# EAGLE design main (EAGLE 9.5.2)
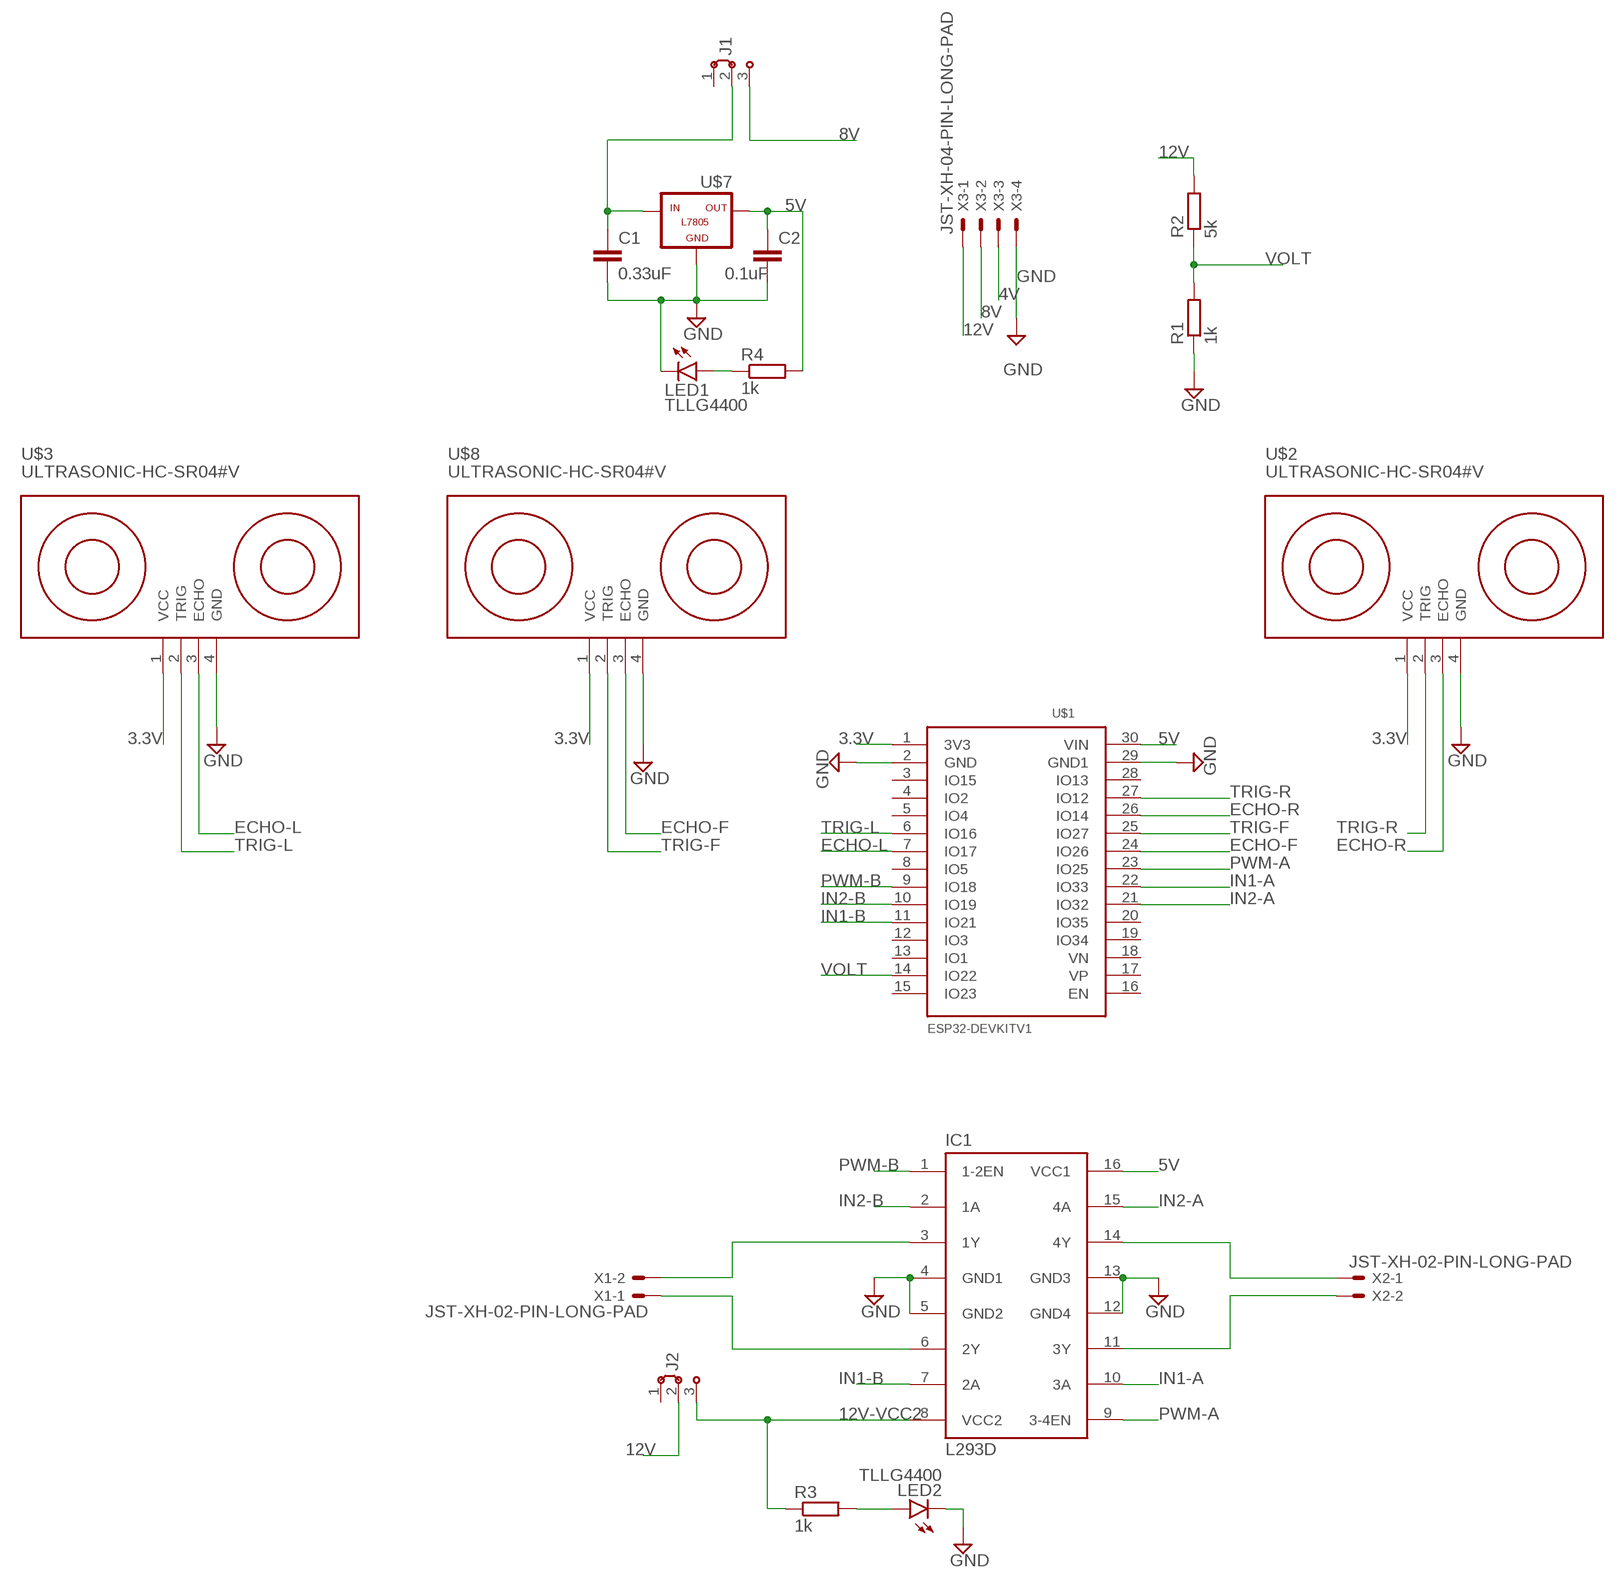
[diagram p0: schematic, sheet 1]

## Parts
C1  0.33uF  C2,5-3  [C2.5-3]
C2  0.1uF  C2,5-3  [C2.5-3]
IC1  L293D  [DIL16]
J1  J2X5MM  [05C]
J2  J2X5MM  [05C]
LED1  TLLG4400  [LED3MM]
LED2  TLLG4400  [LED3MM]
R1  1k  R-EU_0207/10  [0207/10]
R2  5k  R-EU_0207/10  [0207/10]
R3  1k  R-EU_0207/10  [0207/10]
R4  1k  R-EU_0207/10  [0207/10]
U$1  ESP32DEVKITV1  [ESP32-DEVKITV1]
U$2  ULTRASONIC-HC-SR04#V  [ULTRASONIC-HC-SR04#V]
U$3  ULTRASONIC-HC-SR04#V  [ULTRASONIC-HC-SR04#V]
U$7  -L7805  [L7805]
U$8  ULTRASONIC-HC-SR04#V  [ULTRASONIC-HC-SR04#V]
X1  JST-XH-02-PIN-LONG-PAD  [JST-XH-02-PACKAGE-LONG-PAD]
X2  JST-XH-02-PIN-LONG-PAD  [JST-XH-02-PACKAGE-LONG-PAD]
X3  JST-XH-04-PIN-LONG-PAD  [JST-XH-04-PACKAGE-LONG-PAD]

## Nets
3.3V: U$1.1(3V3) U$2.1(VCC) U$3.1(VCC) U$8.1(VCC)
4V: X3.3
5V: C2.1 IC1.16(VCC1) R4.2 U$1.30(VIN) U$7.OUT
8V: J1.3 X3.2
12V: J2.2 R2.2 X3.1
12V-VCC2: IC1.8(VCC2) J2.3 R3.1
ECHO-F: U$1.24(IO26) U$8.3(ECHO)
ECHO-L: U$1.7(IO17) U$3.3(ECHO)
ECHO-R: U$1.26(IO14) U$2.3(ECHO)
GND: C1.2 C2.2 IC1.4(GND1) IC1.5(GND2) IC1.12(GND4) IC1.13(GND3) LED1.K(C) LED2.K(C) R1.1 U$1.2(GND) U$2.4(GND) U$3.4(GND) U$7.GND U$8.4(GND) X3.4
IN1-A: IC1.10(3A) U$1.22(IO33)
IN1-B: IC1.7(2A) U$1.11(IO21)
IN2-A: IC1.15(4A) U$1.21(IO32)
IN2-B: IC1.2(1A) U$1.10(IO19)
N$1: IC1.3(1Y) X1.2
N$2: IC1.6(2Y) X1.1
N$3: IC1.14(4Y) X2.1
N$4: IC1.11(3Y) X2.2
N$5: LED1.A R4.1
N$6: U$1.29(GND1) ; supply symbol labelled GND
N$7: C1.1 J1.2 U$7.IN
N$9: LED2.A R3.2
PWM-A: IC1.9(3-4EN) U$1.23(IO25)
PWM-B: IC1.1(1-2EN) U$1.9(IO18)
TRIG-F: U$1.25(IO27) U$8.2(TRIG)
TRIG-L: U$1.6(IO16) U$3.2(TRIG)
TRIG-R: U$1.27(IO12) U$2.2(TRIG)
VOLT: R1.2 R2.1 U$1.14(IO22)
Unconnected: J1.1 J2.1 U$1.3(IO15) U$1.4(IO2) U$1.5(IO4) U$1.8(IO5) U$1.12(IO3) U$1.13(IO1) U$1.15(IO23) U$1.16(EN) U$1.17(VP) U$1.18(VN) U$1.19(IO34) U$1.20(IO35) U$1.28(IO13)

## Library data of the parts
C1 C2 = capacitor-wima:C: CAPACITOR naming: grid - package width
IC1 = st-microelectronics:L293D: PUSH-PULL 4 CHANNEL DRIVER
J1 J2 = jumper:J2: Jumper switch 2 x 2.5 mm
LED1 LED2 = led:TLLG4400: Low Current (2mA) LED 3 mm Tinted Diffused Package color GREEN Source: Data sheet <http://www.farnell.com/datasheets/391098.pdf>; MF: VISHAY SEMICONDUCTOR; OC_FARNELL: 1612435
R1-R4 = rcl:R-EU_: RESISTOR, European symbol; SPICEPREFIX: R
U$1 = ESP32-DEVKITV1:ESP32DEVKITV1
U$2 U$3 U$8 = diy-modules:ULTRASONIC-HC-SR04: Ultrasonic Ranging Module HC-SR04 More details available here: http://randomnerdtutorials.com/complete-guide-for-ultrasonic-sensor-hc-sr04/ Click here to find device on ebay.com <http://www.ebay.com/sch/hc+sr04+ultrasonic>
U$7 = tango:-L7805
X1 X2 = Rembrandt Electronics - JST XH Connectors v1-0:JST-XH-02-PIN: JST XH Connector 2 Pin Wire to board connector. Pitch: 2,54 mm, (0.100") Number of pins: 2 Created by Rembrandt Electronics www.rembrandtelectronics.com
X3 = Rembrandt Electronics - JST XH Connectors v1-0:JST-XH-04-PIN: JST XH Connector 2 Pin Wire to board connector. Pitch: 2,54 mm, (0.100") Number of pins: 4 Created by Rembrandt Electronics www.rembrandtelectronics.com

## Board
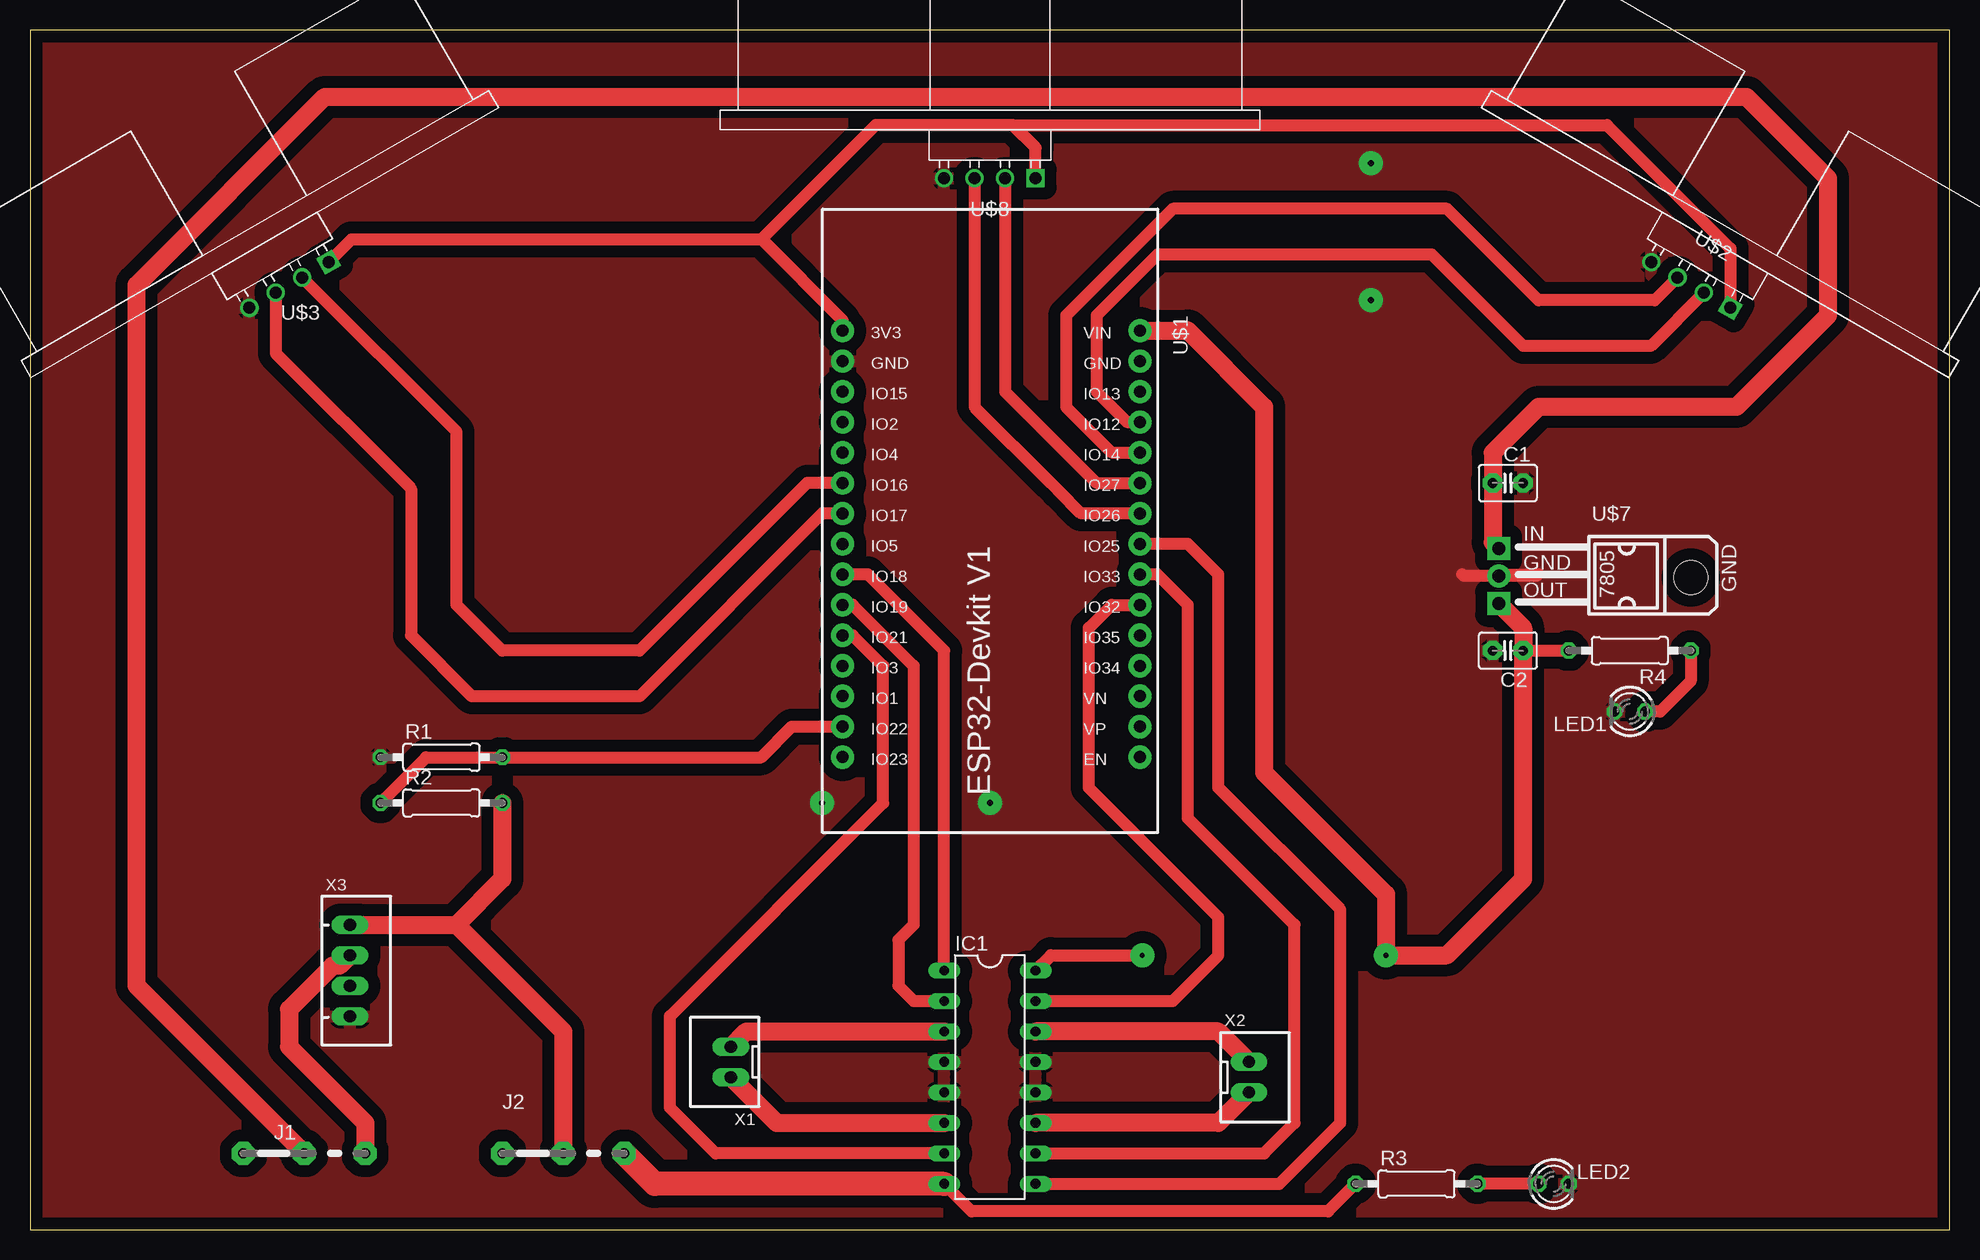
[diagram p1: board, top side]
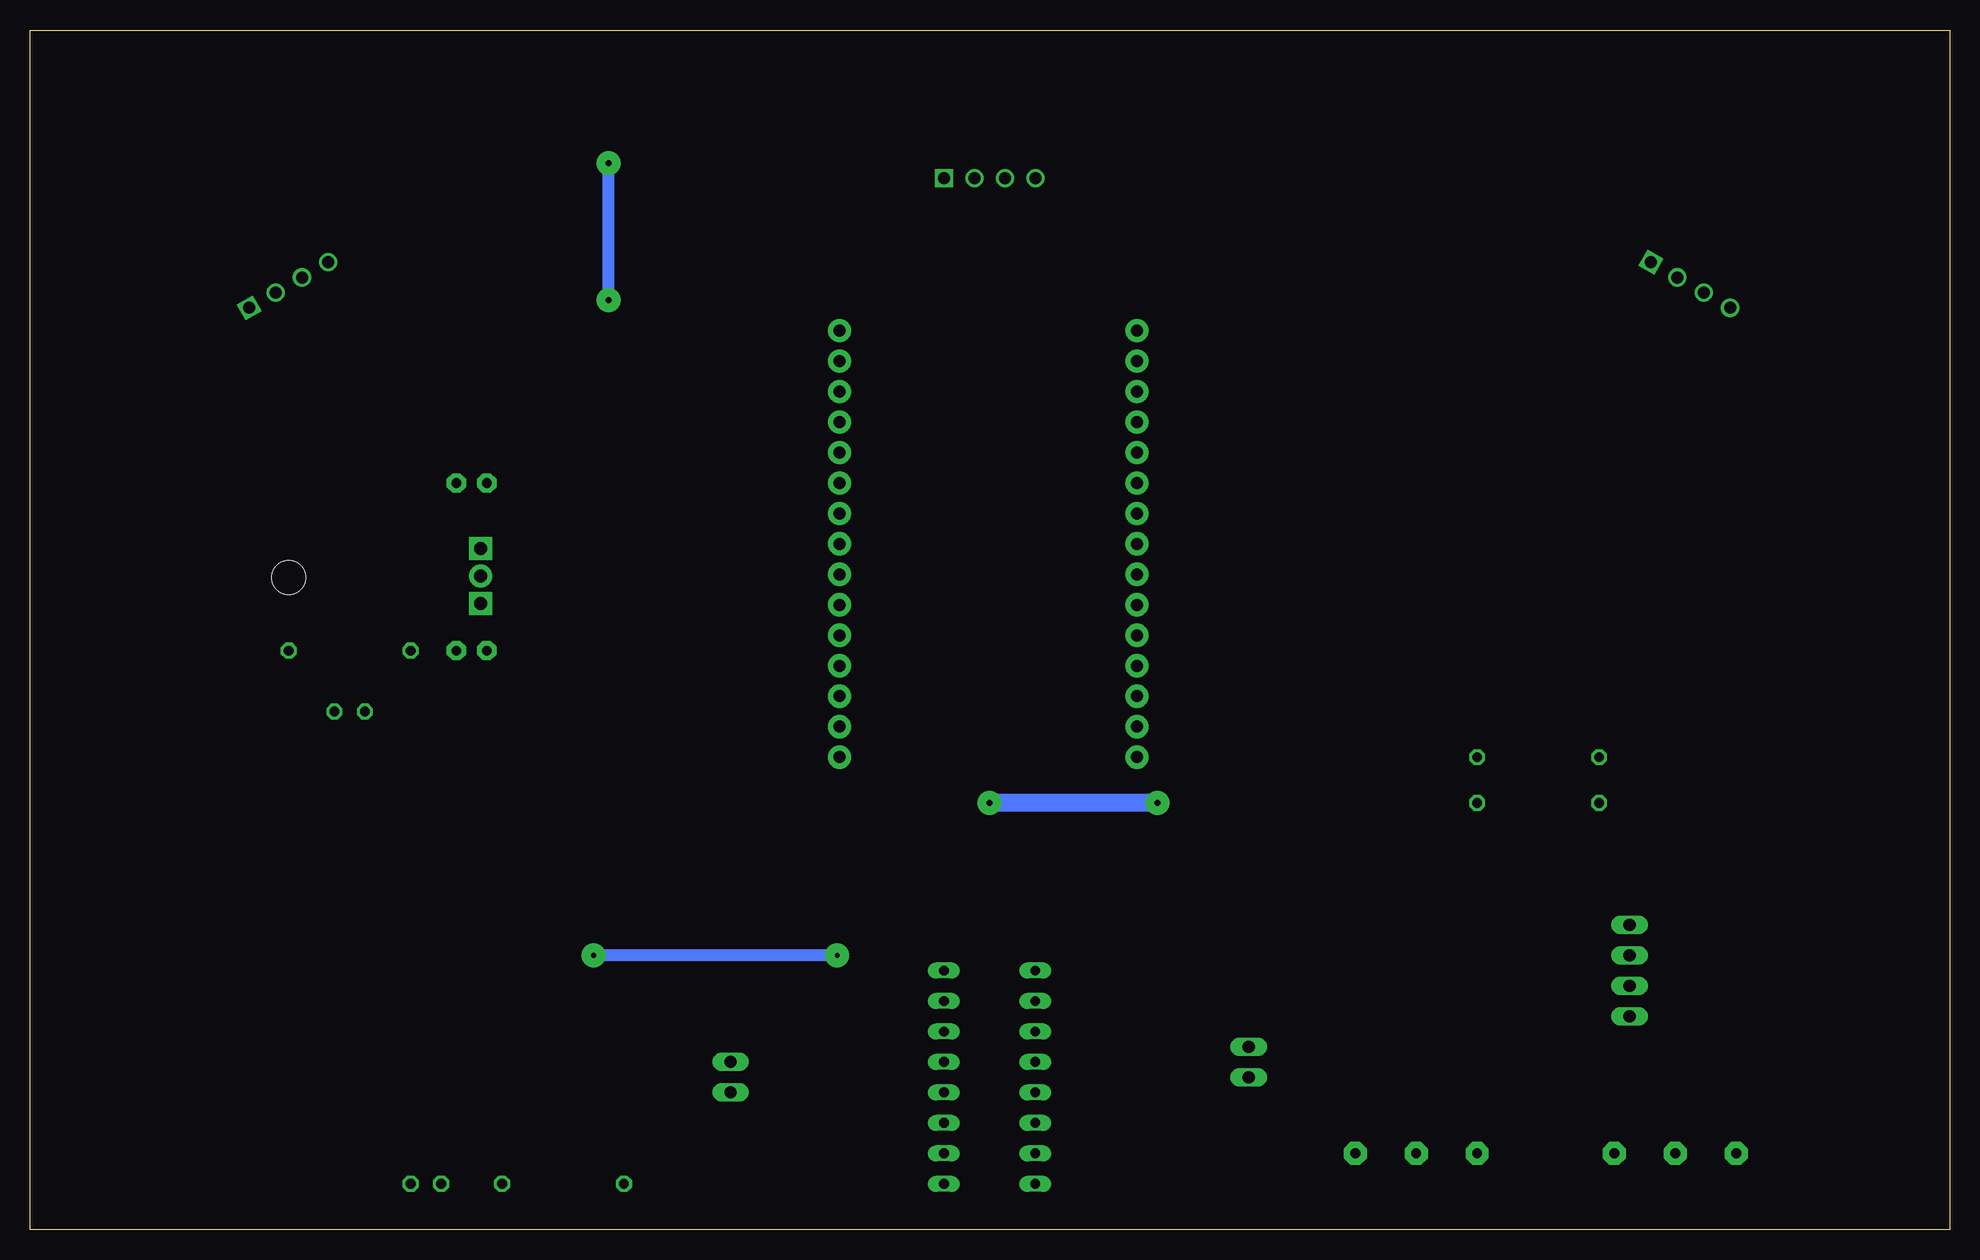
[diagram p2: board, bottom side, seen from below]

Size 160 x 100 mm. Coordinates in mm from the lower left corner, seen from the top.
Outline: 0,0 160,0 160,100 0,100 0,0
Copper layers (1*16): Top 0.035mm / dielectric 1.5mm / Bottom 0.035mm
Design rules "default": minimum track width 6mil, minimum drill 0.35mm, track to track 6mil, track to pad 6mil, pad to pad 6mil, via to via 6mil, smd to smd 6mil, copper to edge 40mil, drill to drill 6mil, minimum pad ring 10mil, minimum via ring 8mil, stop-mask expansion 4mil, vias tented up to drill 0mil, thermal gap 10mil

### Footprints (pad centres in the part's own frame; a part is rotated, then mirrored left to right if it is on the bottom)
C2.5-3 = drill 0.813 pad 1.6 octagon: 1 -1.27,0; 2 1.27,0
DIL16 = drill 0.813 long: 1 -8.89,-3.81; 2 -6.35,-3.81; 3 -3.81,-3.81; 4 -1.27,-3.81; 5 1.27,-3.81; 6 3.81,-3.81; 7 6.35,-3.81; 8 8.89,-3.81; 9 8.89,3.81; 10 6.35,3.81; 11 3.81,3.81; 12 1.27,3.81; 13 -1.27,3.81; 14 -3.81,3.81; 15 -6.35,3.81; 16 -8.89,3.81
05C = drill 0.813 pad 1.905 octagon: 1 -2.54,0; 2 2.54,0; 3 7.62,0
LED3MM = drill 0.813 octagon: A -1.27,0; K 1.27,0
0207/10 = drill 0.813 octagon: 1 -5.08,0; 2 5.08,0
ESP32-DEVKITV1 = drill 1 pad 1.93: 1 -22.87,-13.54; 2 -20.33,-13.54; 3 -17.79,-13.54; 4 -15.25,-13.54; 5 -12.71,-13.54; 6 -10.17,-13.54; 7 -7.63,-13.54; 8 -5.09,-13.54; 9 -2.55,-13.54; 10 -0.01,-13.54; 11 2.53,-13.54; 12 5.07,-13.54; 13 7.61,-13.54; 14 10.15,-13.54; 15 12.69,-13.54; 16 12.69,11.23; 17 10.15,11.23; 18 7.61,11.23; 19 5.07,11.23; 20 2.53,11.23; 21 -0.01,11.23; 22 -2.55,11.23; 23 -5.09,11.23; 24 -7.63,11.23; 25 -10.17,11.23; 26 -12.71,11.23; 27 -15.25,11.23; 28 -17.79,11.23; 29 -20.33,11.23; 30 -22.87,11.23
ULTRASONIC-HC-SR04#V = drill 1 square: 1 -3.81,0 | drill 1: 2 -1.27,0; 3 1.27,0; 4 3.81,0
L7805 = drill 1.1 pad 1.93: GND 0.127,-9.652 | drill 1.1 pad 1.93 square: IN -2.159,-9.652; OUT 2.413,-9.652 | hole 2.8: 0.254,6.35
JST-XH-02-PACKAGE-LONG-PAD = drill 1.016 long: 1 -1.27,0; 2 1.27,0
JST-XH-04-PACKAGE-LONG-PAD = drill 1.016 long: 1 -3.81,0; 2 -1.27,0; 3 1.27,0; 4 3.81,0

### Placement (x,y rotation side)
C1  123.19,62.23 0 top
C2  123.19,48.26 180 top
IC1  80.01,12.7 270 top
J1  20.32,6.35 0 top
J2  41.91,6.35 0 top
LED1  133.35,43.18 180 top
LED2  127,3.81 0 top
R1  34.29,39.37 0 top
R2  34.29,35.56 0 top
R3  115.57,3.81 0 top
R4  133.35,48.26 180 top
U$1  81.28,52.07 270 top
U$2  138.43,78.74 150 top
U$3  21.59,78.74 210 top
U$7  132.08,54.61 270 top
U$8  80.01,87.63 180 top
X1  58.42,13.97 90 top
X2  101.6,12.7 270 top
X3  26.67,21.59 270 top

### Tracks (layer width: path | path; a pad name or v marks a point on that pad's centre or on a via)
3.3V
  Top 1: U$3.1 26.8,82.55 60.96,82.55 | 60.96,82.55 67.74,75.77 U$1.1 | U$8.1 83.82,90.17 81.92,92.08 | 81.92,92.08 70.48,92.08 60.96,82.55 | 81.92,92.08 131.44,92.08 141.73,81.79 U$2.1
5V  (via drill 0.4 pad 2)
  Top 1: C2.1 R4.2 | IC1.16 85.09,22.86 v92.71,22.86
  Top 1.5: U$1.30 96.51,74.94 102.87,68.58 102.87,38.1 113.03,27.94 v113.03,22.86 118.11,22.86 124.46,29.21 C2.1 124.46,50.16 U$7.OUT
  Bottom 1: v92.71,22.86 v113.03,22.86
8V
  Top 1.5: X3.2 25.79,21.98 25.22,21.98 21.59,18.36 21.59,15.24 27.94,8.89 J1.3
12V
  Top 1.5: X3.1 35.56,25.4 | J2.2 44.45,16.51 35.56,25.4 | R2.2 39.37,29.21 35.56,25.4
12V-VCC2
  Top 1: R3.1 108.2,1.52 78.49,1.52 IC1.8
  Top 2: J2.3 52.07,3.81 IC1.8
ECHO-F
  Top 1: U$8.3 78.74,68.58 85.09,62.23 85.72,61.59 | U$1.24 87.62,59.7 85.72,61.59 | 85.72,61.59
ECHO-L
  Top 1: U$3.3 20.49,73.03 31.75,61.77 31.75,49.53 36.83,44.45 50.8,44.45 66.04,59.69 U$1.7
ECHO-R
  Top 1: U$2.3 135.43,77.47 125.73,77.47 118.11,85.09 95.25,85.09 86.36,76.2 86.36,68.58 90.16,64.78 U$1.26
GND  (via drill 0.5 pad 2)
  Top 1: U$7.GND 122.56,54.61 125.73,54.61 125.6,54.48 U$7.GND | U$7.GND 119.51,54.48 119.38,54.61
  Bottom 1: v111.76,77.47 v111.76,88.9
  Bottom 1.5: v66.04,35.56 v80.01,35.56
  pour Top (isolate 1): 0,100.33 160.02,100.33 160.02,0 0,0
IN1-A
  Top 1: IC1.10 102.87,6.35 105.41,8.89 105.41,25.4 96.52,34.29 96.52,52.07 93.97,54.62 U$1.22
IN1-B
  Top 1: IC1.7 57.15,6.35 53.34,10.16 53.34,17.78 71.12,35.56 71.12,46.99 68.57,49.54 U$1.11
IN2-A
  Top 1: IC1.15 86.36,19.05 95.25,19.05 99.06,22.86 99.06,26.04 88.27,36.83 88.27,50.16 90.17,52.07 U$1.21
IN2-B
  Top 1: U$1.10 68.57,52.08 73.66,46.99 73.66,25.4 72.39,24.13 72.39,20.32 73.66,19.05 IC1.2
N$1
  Top 1.5: X1.2 59.69,16.51 IC1.3
N$2
  Top 1.5: X1.1 62.23,8.89 IC1.6
N$3
  Top 1.5: X2.1 99.06,16.51 IC1.14
N$4
  Top 1.5: X2.2 99.06,8.89 IC1.11
N$5
  Top 1: LED1.A 135.89,43.18 138.43,45.72 R4.1
N$7
  Top 1.5: U$7.IN 121.92,57.28 C1.1 121.92,64.77 125.73,68.58 142.24,68.58 149.86,76.2 149.86,87.63 143.07,94.42 24.57,94.42 8.89,78.74 8.89,20.32 J1.2
N$9
  Top 1: LED2.A R3.2
PWM-A
  Top 1: IC1.9 104.14,3.81 109.22,8.89 109.22,26.67 99.06,36.83 99.06,54.61 96.51,57.16 U$1.23
PWM-B
  Top 1: IC1.1 76.2,48.26 69.84,54.62 U$1.9
TRIG-F
  Top 1: U$1.25 88.9,62.23 81.28,69.85 U$8.2
TRIG-L
  Top 1: U$1.6 64.78,62.24 50.8,48.26 39.37,48.26 35.56,52.07 35.56,66.5 U$3.2
TRIG-R
  Top 1: U$1.27 91.43,67.32 88.9,69.85 88.9,76.2 93.98,81.28 116.84,81.28 124.46,73.66 135.09,73.66 U$2.2
VOLT
  Top 1: U$1.14 63.51,41.92 60.96,39.37 R1.2 33.02,39.37 R2.1